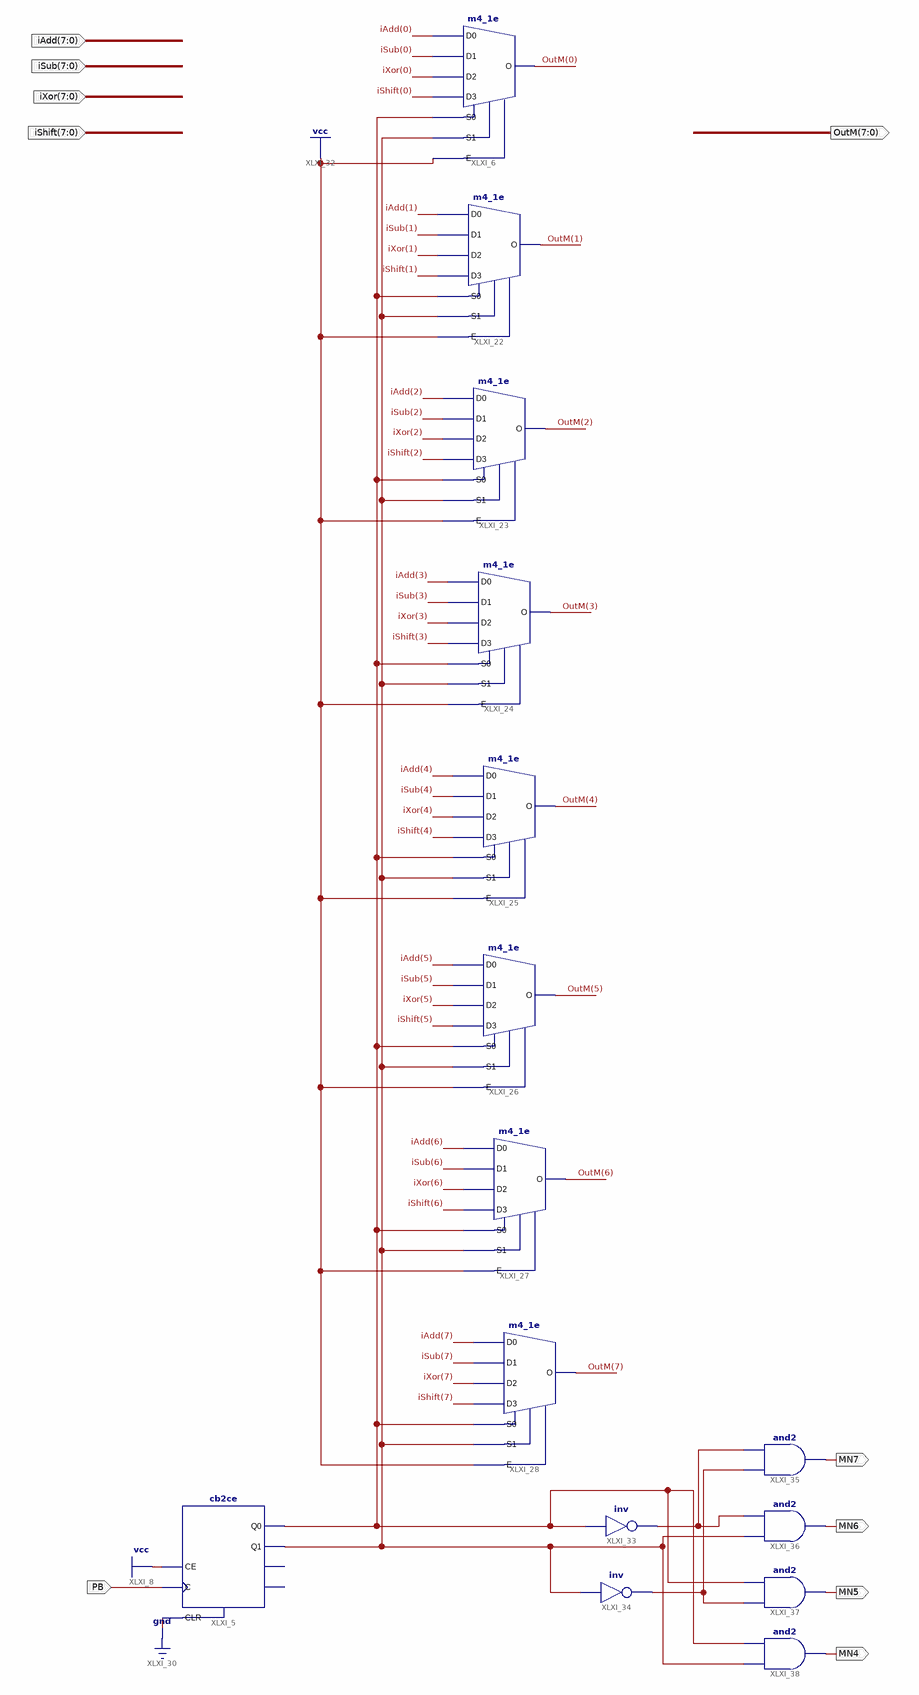
[diagram p0: schematic sheet 1]
// Xilinx ISE schematic Mux32.sch (spartan6) as structural Verilog: 15 symbols, 10 ports
module Mux32 (
  input  [7:0] iXor,
  input  [7:0] iShift,
  input  [7:0] iSub,
  input  [7:0] iAdd,
  input  PB,
  output [7:0] OutM,
  output MN7,
  output MN6,
  output MN5,
  output MN4
);

  wire XLXN_98, XLXN_99, XLXN_100, XLXN_101;

  m4_1e XLXI_6 (
    .D0(iAdd[0]), .D1(iSub[0]), .D2(iXor[0]), .D3(iShift[0]), .E(1'b1), .S0(XLXN_98), .S1(XLXN_99),
    .O(OutM[0]));
  m4_1e XLXI_22 (
    .D0(iAdd[1]), .D1(iSub[1]), .D2(iXor[1]), .D3(iShift[1]), .E(1'b1), .S0(XLXN_98), .S1(XLXN_99),
    .O(OutM[1]));
  m4_1e XLXI_23 (
    .D0(iAdd[2]), .D1(iSub[2]), .D2(iXor[2]), .D3(iShift[2]), .E(1'b1), .S0(XLXN_98), .S1(XLXN_99),
    .O(OutM[2]));
  m4_1e XLXI_24 (
    .D0(iAdd[3]), .D1(iSub[3]), .D2(iXor[3]), .D3(iShift[3]), .E(1'b1), .S0(XLXN_98), .S1(XLXN_99),
    .O(OutM[3]));
  m4_1e XLXI_25 (
    .D0(iAdd[4]), .D1(iSub[4]), .D2(iXor[4]), .D3(iShift[4]), .E(1'b1), .S0(XLXN_98), .S1(XLXN_99),
    .O(OutM[4]));
  m4_1e XLXI_26 (
    .D0(iAdd[5]), .D1(iSub[5]), .D2(iXor[5]), .D3(iShift[5]), .E(1'b1), .S0(XLXN_98), .S1(XLXN_99),
    .O(OutM[5]));
  m4_1e XLXI_27 (
    .D0(iAdd[6]), .D1(iSub[6]), .D2(iXor[6]), .D3(iShift[6]), .E(1'b1), .S0(XLXN_98), .S1(XLXN_99),
    .O(OutM[6]));
  m4_1e XLXI_28 (
    .D0(iAdd[7]), .D1(iSub[7]), .D2(iXor[7]), .D3(iShift[7]), .E(1'b1), .S0(XLXN_98), .S1(XLXN_99),
    .O(OutM[7]));
  cb2ce XLXI_5 (.C(PB), .CE(1'b1), .CLR(1'b0), .Q0(XLXN_98), .Q1(XLXN_99));  // open: CEO, TC
  not XLXI_33 (XLXN_100, XLXN_98);
  not XLXI_34 (XLXN_101, XLXN_99);
  and XLXI_35 (MN7, XLXN_101, XLXN_100);
  and XLXI_36 (MN6, XLXN_99, XLXN_100);
  and XLXI_37 (MN5, XLXN_101, XLXN_98);
  and XLXI_38 (MN4, XLXN_99, XLXN_98);
endmodule
